# Altium project EDR Project.PrjPcb
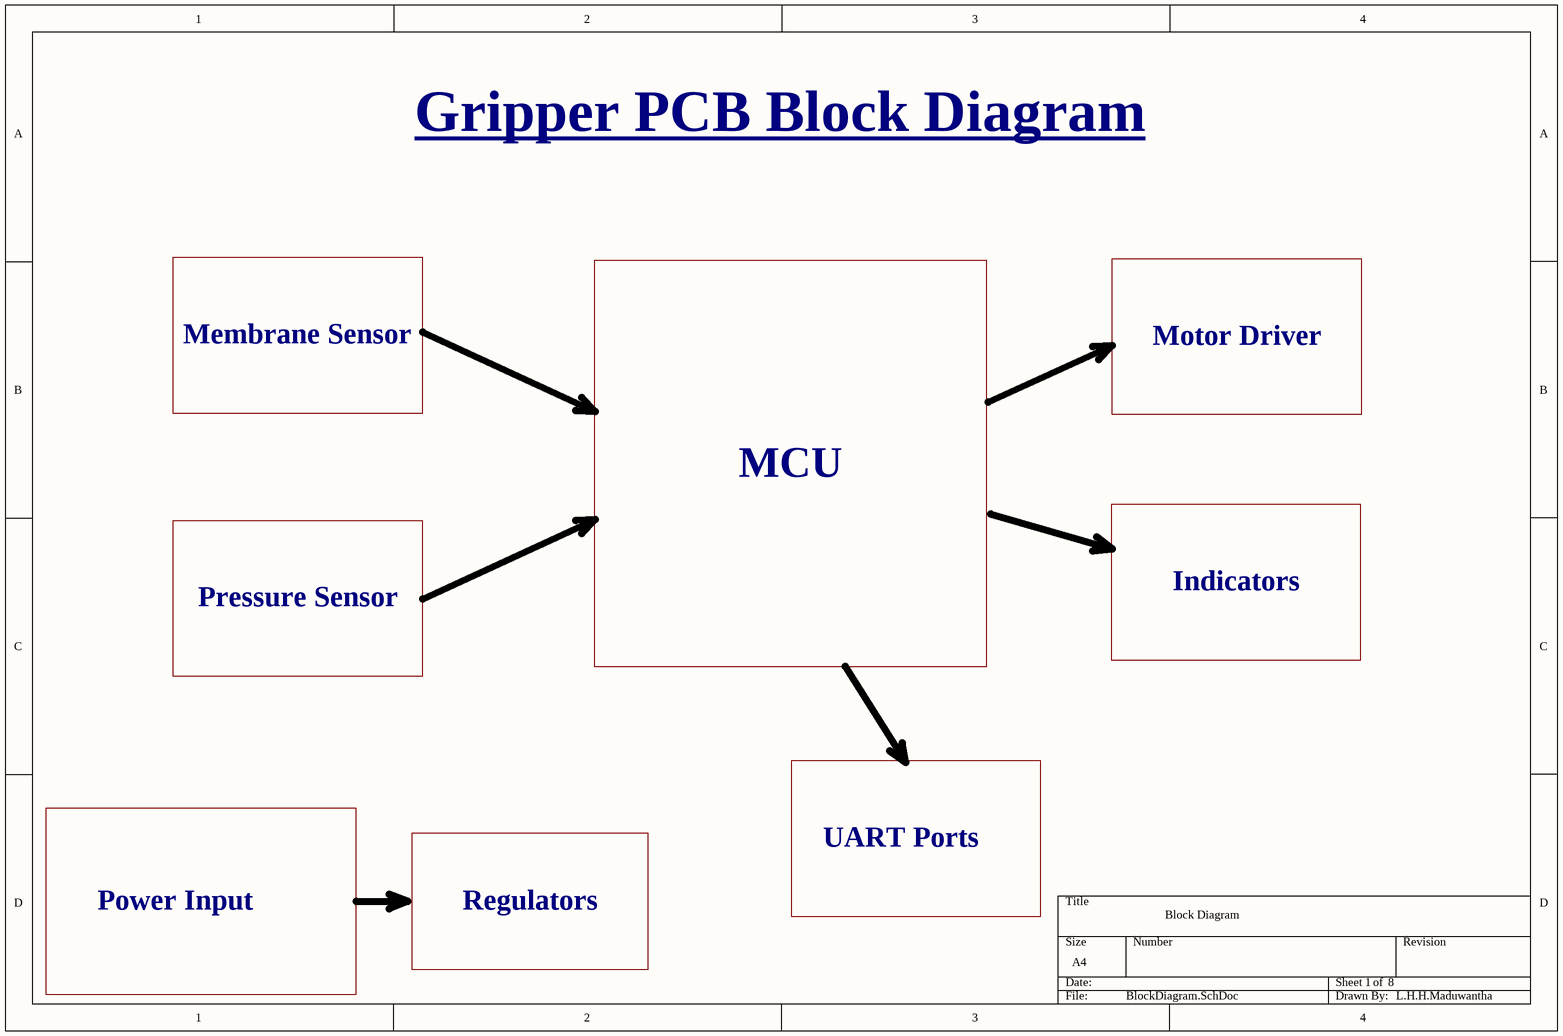
[diagram p0: BlockDiagram.SchDoc]
8 sheets, 58 parts. Net scope: hierarchical (ports join the sheet entries above them; power ports are global).
Board file: EDR Project pcb.PcbDoc
Sheets:
  BlockDiagram.SchDoc
  Main.SchDoc
    MCU = MCU.SchDoc
    POWER = Power.SchDoc
    MOTOR DRIVER = MotorDriver.SchDoc
    MEMBRANE SENSOR = MembraneSensor.SchDoc
    PRESSURE SENSOR = PressureSensor.SchDoc
    UART = UART_COM.SchDoc

## Sheet BlockDiagram.SchDoc
size A4; SheetNumber: 1; SheetTotal: 8

### Notes on the sheet
- Gripper PCB Block Diagram
- Membrane Sensor
- Motor Driver
- MCU
- Pressure Sensor
- Indicators
- UART Ports
- Power Input
- Regulators
- Block Diagram
- L.H.H.Maduwantha

## Sheet Main.SchDoc
size A4; SheetNumber: 2; SheetTotal: 8
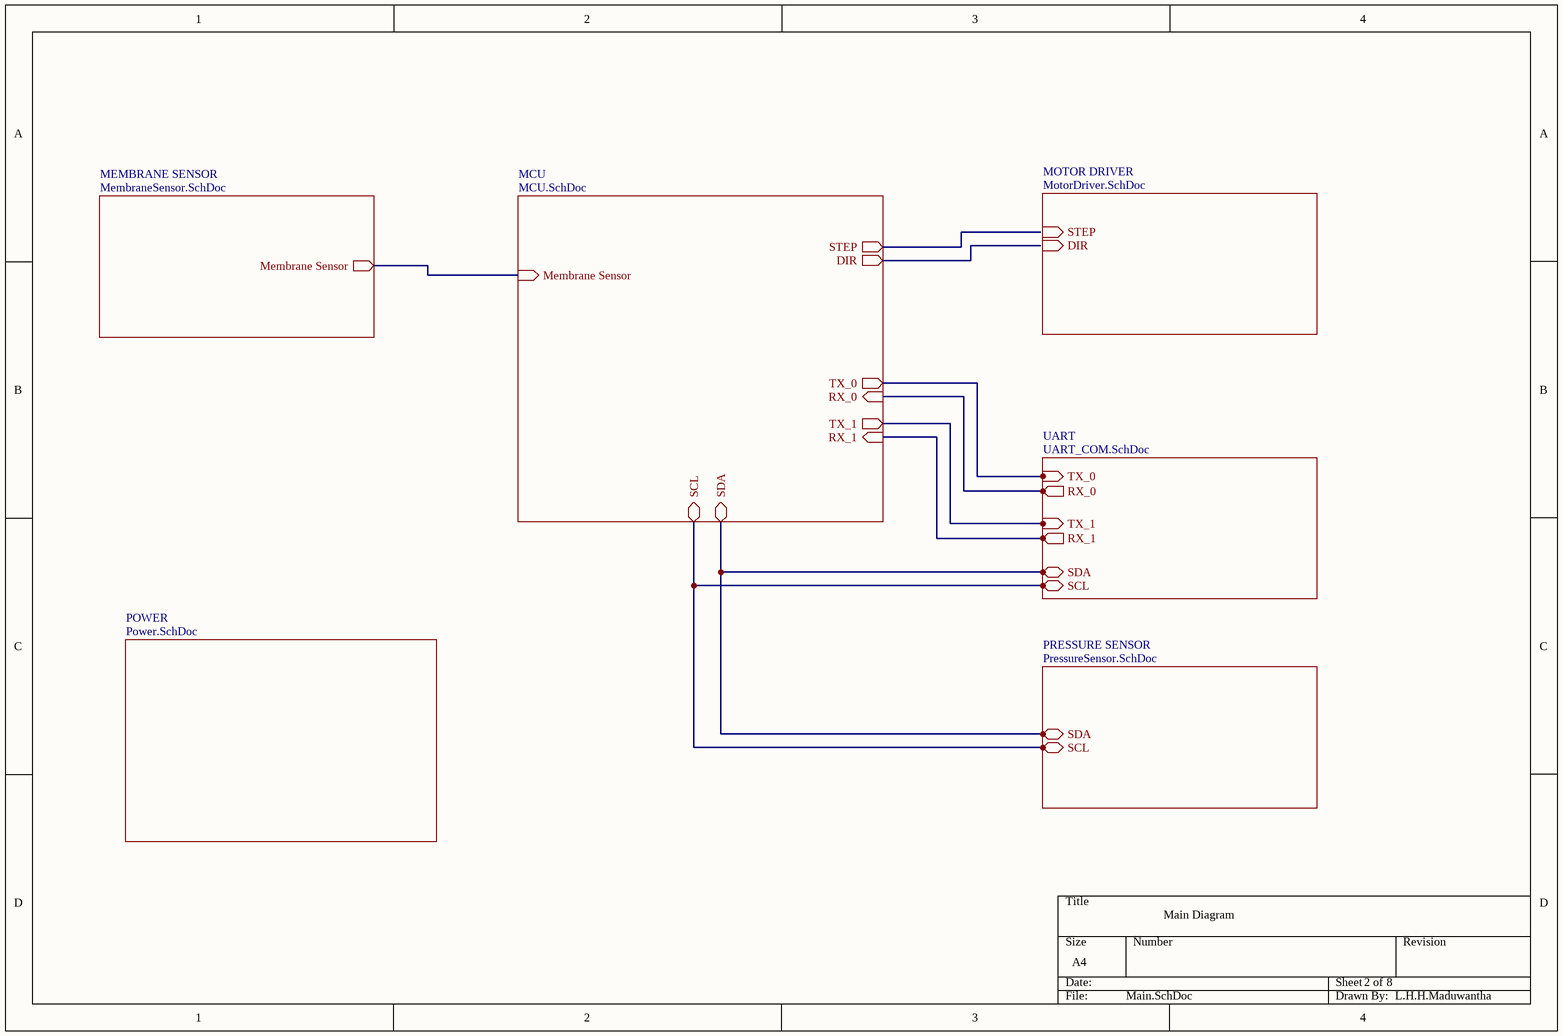
[diagram p1: Main.SchDoc]

### Sub-sheets
MCU = MCU.SchDoc: TX_1 (out), RX_1 (in), TX_0 (out), RX_0 (in), SCL (bidir), SDA (bidir), STEP (out), DIR (out), Membrane Sensor (in)
MEMBRANE SENSOR = MembraneSensor.SchDoc: Membrane Sensor (out)
MOTOR DRIVER = MotorDriver.SchDoc: STEP (in), DIR (in)
POWER = Power.SchDoc: no entries
PRESSURE SENSOR = PressureSensor.SchDoc: SDA (bidir), SCL (bidir)
UART = UART_COM.SchDoc: TX_0 (in), RX_0 (out), SDA (bidir), SCL (bidir), TX_1 (in), RX_1 (out)

### Nets
SCL: sheet MCU/SCL, sheet PRESSURE SENSOR/SCL, sheet UART/SCL
SDA: sheet MCU/SDA, sheet PRESSURE SENSOR/SDA, sheet UART/SDA
NetIC1_2: sheet MCU/RX_0, sheet UART/RX_0
NetIC1_3: sheet MCU/TX_0, sheet UART/TX_0
NetIC1_45: sheet MCU/RX_1, sheet UART/RX_1
NetIC1_46: sheet MCU/TX_1, sheet UART/TX_1
NetIC1_97: sheet MCU/Membrane Sensor, sheet MEMBRANE SENSOR/Membrane Sensor

### Notes on the sheet
- Main Diagram
- L.H.H.Maduwantha

## Sheet MCU.SchDoc
size A4; SheetNumber: 3; SheetTotal: 8
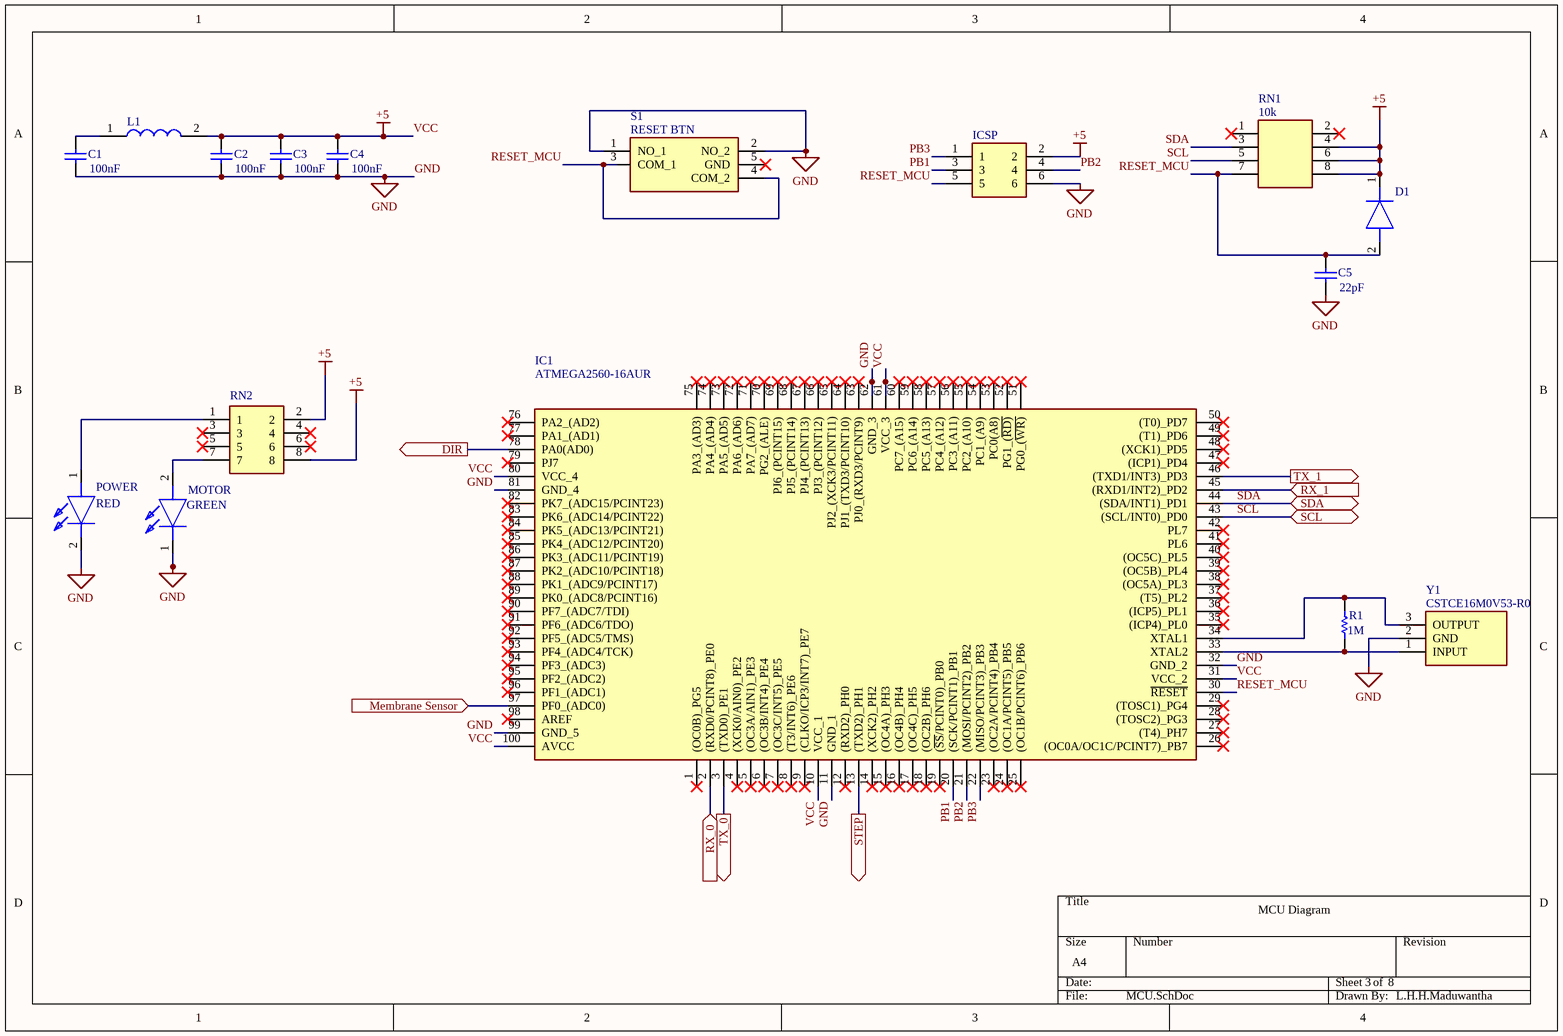
[diagram p2: MCU.SchDoc]

### Parts
C1  value 100nF  [CAPC1608X90X35LL15T15]  (hidden comment: 06035C104KAT4A)
C2  value 100nF  [CAPC1608X90X35LL15T15]  (hidden comment: 06035C104KAT4A)
C3  value 100nF  [CAPC1608X90X35LL15T15]  (hidden comment: 06035C104KAT4A)
C4  value 100nF  [CAPC1608X90X35LL15T15]  (hidden comment: 06035C104KAT4A)
C5  value 22pF  [CAPC1608X90X35NL15T15]  (hidden comment: 06035A220JAT4A)
D1  CD1206-S01575  [DIOC3215X95N]  (value not drawn)
IC1  ATMEGA2560-16AUR  [QFP50P1600X1600X120-100N]
ICSP  PH2-06-UA  [HDRV6W64P254_2X3_762X500X901P]  (value not drawn)
L1  CV201210-100K  [INDC2012X145N]  (value not drawn)
MOTOR  Color: GREEN  [LEDM2012X120N]  (hidden comment: KPT-2012SGC)
POWER  COLOR: RED  [APT2012SECKJ3PRV]  (hidden comment: APT2012SECK_J3-PRV)
R1  value 1M  [RESC1608X55X30NL15T15]  (hidden comment: ERJ-3GEYJ105V)
RN1  value 10k  [CAY16-J4]  (hidden comment: CAY16-103J4GLF)
RN2  CAY16-102J4LF  [CAY16-103J4LF]  (value not drawn)
S1  NAME: RESET BTN  [15716363]  (hidden comment: 1571636-3)
Y1  CSTCE16M0V53-R0  [CSTCE16M0V53R0]

### Ports
DIR (out, see Main[3A]), Membrane Sensor (in, see Main[2B], MembraneSensor[2B]), RX_0 (in, see Main[3B], UART_COM[2B]), RX_1 (in, see Main[3B], UART_COM[2B]), SCL (bidir, see Main[2C], PressureSensor[2C], UART_COM[2C]), SDA (bidir, see Main[2C], PressureSensor[2C], UART_COM[2C]), STEP (out, see Main[3A]), TX_0 (out, see Main[3B], UART_COM[2B]), TX_1 (out, see Main[3B], UART_COM[2B])

### Nets
GND: C1.1 C2.1 C3.1 C4.1 C5.1 IC1.11(GND_1) IC1.32(GND_2) IC1.62(GND_3) IC1.81(GND_4) IC1.99(GND_5) ICSP.6 MOTOR.1(K) POWER.2(K) S1.1(NO_1) S1.2(NO_2) Y1.2(GND)
VCC: C2.2 C3.2 C4.2 D1.1(K) IC1.10(VCC_1) IC1.31(VCC_2) IC1.61(VCC_3) IC1.80(VCC_4) IC1.100(AVCC) ICSP.2 L1.2 RN1.4 RN1.6 RN1.8 RN2.2 RN2.8  [also labelled +5]
PB1: IC1.20((SCK/PCINT1)_PB1) ICSP.3
PB2: IC1.21((MOSI/PCINT2)_PB2) ICSP.4
PB3: IC1.22((MISO/PCINT3)_PB3) ICSP.1
RESET_MCU: C5.2 D1.2(A) IC1.30(~{RESET}) ICSP.5 RN1.7 S1.3(COM_1) S1.4(COM_2)
SCL: IC1.43((SCL/INT0)_PD0) RN1.5 ; port SCL
SDA: IC1.44((SDA/INT1)_PD1) RN1.3 ; port SDA
NetC1_2: C1.2 L1.1
NetIC1_2: IC1.2((RXD0/PCINT8)_PE0) ; port RX_0
NetIC1_3: IC1.3((TXD0)_PE1) ; port TX_0
NetIC1_13: IC1.13((TXD2)_PH1) ; port STEP
NetIC1_33: IC1.33(XTAL2) R1.1 Y1.1(INPUT)
NetIC1_34: IC1.34(XTAL1) R1.2 Y1.3(OUTPUT)
NetIC1_45: IC1.45((RXD1/INT2)_PD2) ; port RX_1
NetIC1_46: IC1.46((TXD1/INT3)_PD3) ; port TX_1
NetIC1_78: IC1.78(PA0(AD0)) ; port DIR
NetIC1_97: IC1.97(PF0_(ADC0)) ; port Membrane Sensor
NetMOTOR_2: MOTOR.2(A) RN2.7
NetPOWER_1: POWER.1(A) RN2.1

Not connected (* = marked no-connect by the designer): IC1 1((OC0B)_PG5)* 4((XCK0/AIN0)_PE2)* 5((OC3A/AIN1)_PE3)* 6((OC3B/INT4)_PE4)* 7((OC3C/INT5)_PE5)* 8((T3/INT6)_PE6)* 9((CLKO/ICP3/INT7)_PE7)* 12((RXD2)_PH0)* 14((XCK2)_PH2)* 15((OC4A)_PH3)* 16((OC4B)_PH4)* 17((OC4C)_PH5)* 18((OC2B)_PH6)* 19((~{SS}/PCINT0)_PB0)* 23((OC2A/PCINT4)_PB4)* 24((OC1A/PCINT5)_PB5)* 25((OC1B/PCINT6)_PB6)* 26((OC0A/OC1C/PCINT7)_PB7)* 27((T4)_PH7)* 28((TOSC2)_PG3)* 29((TOSC1)_PG4)* 35((ICP4)_PL0)* 36((ICP5)_PL1)* 37((T5)_PL2)* 38((OC5A)_PL3)* 39((OC5B)_PL4)* 40((OC5C)_PL5)* 41(PL6)* 42(PL7)* 47((ICP1)_PD4)* 48((XCK1)_PD5)* 49((T1)_PD6)* 50((T0)_PD7)* 51(PG0_(~{WR)})* 52(PG1_(~{RD)})* 53(PC0(A8))* 54(PC1_(A9))* 55(PC2_(A10))* 56(PC3_(A11))* 57(PC4_(A12))* 58(PC5_(A13))* 59(PC6_(A14))* 60(PC7_(A15))* 63(PJ0_(RXD3/PCINT9))* 64(PJ1_(TXD3/PCINT10))* 65(PJ2_(XCK3/PCINT11))* 66(PJ3_(PCINT12))* 67(PJ4_(PCINT13))* 68(PJ5_(PCINT14))* 69(PJ6_(PCINT15))* 70(PG2_(ALE))* 71(PA7_(AD7))* 72(PA6_(AD6))* 73(PA5_(AD5))* 74(PA4_(AD4))* 75(PA3_(AD3))* 76(PA2_(AD2))* 77(PA1_(AD1))* 79(PJ7)* 82(PK7_(ADC15/PCINT23))* 83(PK6_(ADC14/PCINT22))* 84(PK5_(ADC13/PCINT21))* 85(PK4_(ADC12/PCINT20))* 86(PK3_(ADC11/PCINT19))* 87(PK2_(ADC10/PCINT18))* 88(PK1_(ADC9/PCINT17))* 89(PK0_(ADC8/PCINT16))* 90(PF7_(ADC7/TDI))* 91(PF6_(ADC6/TDO))* 92(PF5_(ADC5/TMS))* 93(PF4_(ADC4/TCK))* 94(PF3_(ADC3))* 95(PF2_(ADC2))* 96(PF1_(ADC1))* 98(AREF)*; RN1 1* 2*; RN2 3* 4* 5* 6*; S1 5(GND)*

### Notes on the sheet
- MCU Diagram
- L.H.H.Maduwantha

### Library data of the parts
C1-C4 = CMP-2006-04390-1: Manufacturer: AVX Interconnect / Elco; Part Number: 06035C104KAT4A
C5 = CMP-2006-04271-1: Manufacturer: AVX Interconnect / Elco; Part Number: 06035A220JAT4A
D1 = CD1206-S01575: Diode; Manufacturer_Name: Bourns; Datasheet Link: https://datasheet.datasheetarchive.com/originals/distributors/SFDatasheet-7/sf-000140098.pdf; Height: 0.95mm; Manufacturer_Part_Number: CD1206-S01575; Mouser Part Number: 652-CD1206-S01575; Mouser Price/Stock: https://www.mouser.co.uk/ProductDetail/Bourns/CD1206-S01575?qs=FITO%2F%2FQgYDlGQsqciGRLTg%3D%3D; Arrow Part Number: CD1206-S01575; Arrow Price/Stock: https://www.arrow.com/en/products/cd1206-s01575/bourns
IC1 = ATMEGA2560-16AUR: Integrated Circuit; Manufacturer_Name: Microchip; Datasheet Link: http://ww1.microchip.com/downloads/en/DeviceDoc/Atmel-2549-8-bit-AVR-Microcontroller-ATmega640-1280-1281-2560-2561_datasheet.pdf; Height: 1.2mm; Manufacturer_Part_Number: ATMEGA2560-16AUR; Mouser Part Number: 556-ATMEGA2560-16AUR; Mouser Price/Stock: https://www.mouser.co.uk/ProductDetail/Microchip-Technology/ATMEGA2560-16AUR?qs=6Dg1WZIWLC5tcX5fO8xzXQ%3D%3D; Arrow Part Number: ATMEGA2560-16AUR; Arrow Price/Stock: https://www.arrow.com/en/products/atmega2560-16aur/microchip-technology?region=nac
ICSP = PH2-06-UA: Connector; Manufacturer_Name: Adam Tech; Datasheet Link: https://datasheet.datasheetarchive.com/originals/distributors/Datasheets_SAMA/c63e3fe101e7b6e3957e7ad4a1a98367.pdf; Height: 9.008mm; Manufacturer_Part_Number: PH2-06-UA; Arrow Part Number: PH2-06-UA; Arrow Price/Stock: https://www.arrow.com/en/products/ph2-06-ua/adam-tech?region=nac
L1 = CV201210-100K: Inductor; Manufacturer_Name: Bourns; Datasheet Link: https://www.bourns.com/docs/Product-Datasheets/CV201210.pdf; Height: 1.45mm; Manufacturer_Part_Number: CV201210-100K; Mouser Part Number: 652-CV201210-100K; Mouser Price/Stock: https://www.mouser.co.uk/ProductDetail/Bourns/CV201210-100K?qs=k2%252BVLg4AuuRLt64STpwovw%3D%3D; Arrow Part Number: CV201210-100K; Arrow Price/Stock: https://www.arrow.com/en/products/cv201210-100k/bourns?region=nac
MOTOR = KPT-2012SGC: LED; Manufacturer_Name: Kingbright; Datasheet Link: https://componentsearchengine.com/Datasheets/2/KPT-2012SGC.pdf; Height: 1.2mm; Manufacturer_Part_Number: KPT-2012SGC; Mouser Part Number: N/A; Mouser Price/Stock: https://www.mouser.co.uk/ProductDetail/Kingbright/KPT-2012SGC?qs=2JU0tDl2GZ3Evsz5LVxRxw%3D%3D; Arrow Part Number: KPT-2012SGC; Arrow Price/Stock: https://www.arrow.com/en/products/kpt-2012sgc/kingbright?region=europe
POWER = APT2012SECK_J3-PRV: LED; Manufacturer_Name: Kingbright; Manufacturer_Part_Number: APT2012SECK/J3-PRV; Datasheet Link: https://www.mouser.de/datasheet/2/216/APT2012SECK-J3-PRV-1173389.pdf; Height: 0.85mm; Mouser Part Number: 604-APT2012SECKJ3PRV; Mouser Price/Stock: https://www.mouser.co.uk/ProductDetail/Kingbright/APT2012SECK-J3-PRV?qs=D2TOvUWgdJ6T9J6WfI%252BQOg%3D%3D; Arrow Part Number: APT2012SECK/J3-PRV; Arrow Price/Stock: https://www.arrow.com/en/products/apt2012seckj3-prv/kingbright?region=nac
R1 = CMP-2000-00706-1: Manufacturer: Panasonic; Part Number: ERJ-3GEYJ105V
RN1 = CAY16-103J4GLF: Resistor Network; Manufacturer_Name: Bourns; Datasheet Link: http://www.bourns.com/docs/Product-Datasheets/CATCAY.pdf; Manufacturer_Part_Number: CAY16-103J4GLF; Mouser Part Number: 652-CAY16-103J4GLF; Mouser Price/Stock: https://www.mouser.co.uk/ProductDetail/Bourns/CAY16-103J4GLF?qs=ehdiChDUEdVKSWacpiiZig%3D%3D; Arrow Part Number: CAY16-103J4GLF; Arrow Price/Stock: https://www.arrow.com/en/products/cay16-103j4glf/bourns
RN2 = CAY16-102J4LF: Resistor Network; Manufacturer_Name: Bourns; Datasheet Link: http://www.bourns.com/docs/Product-Datasheets/CATCAY.pdf; Manufacturer_Part_Number: CAY16-102J4LF; Mouser Part Number: 652-CAY16-102J4LF; Mouser Price/Stock: https://www.mouser.co.uk/ProductDetail/Bourns/CAY16-102J4LF?qs=LCMWAU1DZcxTp%252BoNHGBb3Q%3D%3D; Arrow Part Number: CAY16-102J4LF; Arrow Price/Stock: https://www.arrow.com/en/products/cay16-102j4lf/bourns?region=europe
S1 = 1571636-3: Switch; Manufacturer_Name: TE Connectivity; Datasheet Link: https://www.mouser.com/datasheet/2/418/NG_CD_1571636_C2-652439.pdf; Height: 2.5mm; Manufacturer_Part_Number: 1571636-3; Mouser Part Number: 506-1571636-3; Mouser Price/Stock: https://www.mouser.co.uk/ProductDetail/TE-Connectivity-Alcoswitch/1571636-3?qs=9qK3lZr%252Bi0Iiy0ZiPH8Cfg%3D%3D
Y1 = CSTCE16M0V53-R0: Crystal or Oscillator; Manufacturer_Name: Murata Electronics; Value: 16MHz; Datasheet Link: https://www.murata.com/en-sg/products/productdetail?partno=CSTCE16M0V53-R0; Height: 1mm; Manufacturer_Part_Number: CSTCE16M0V53-R0; Mouser Part Number: 81-CSTCE16M0V53-R0; Mouser Price/Stock: https://www.mouser.co.uk/ProductDetail/Murata-Electronics/CSTCE16M0V53-R0?qs=HPA2Xx%252BU0WhPWbRcNuzhZw%3D%3D

## Sheet Power.SchDoc
size A4; SheetNumber: 5; SheetTotal: 8
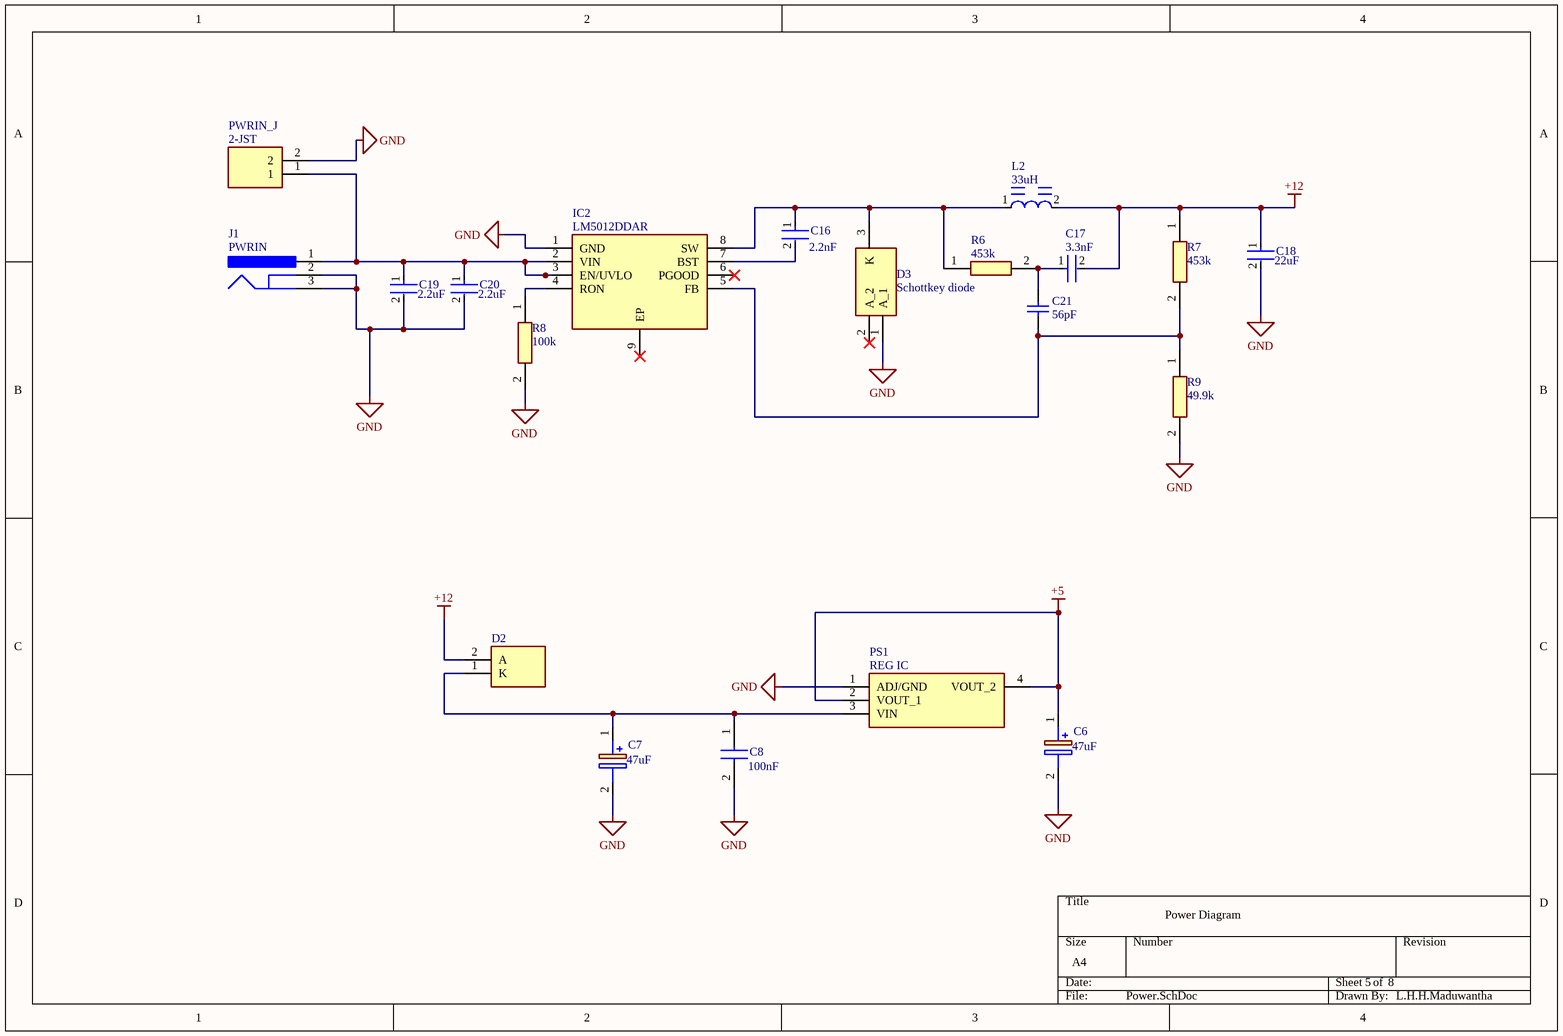
[diagram p3: Power.SchDoc]

### Parts
C6  value 47uF  [EEE1AA101SP]  (hidden comment: EEE-1EA470WP)
C7  value 47uF  [EEE1AA101SP]  (hidden comment: EEE-1EA470WP)
C8  Capacitance: 100nF  [C0603]  (hidden comment: C0603C104K5RAC3190)
C16  Capacitance: 2.2nF  [FP-GRM155-0_05-IPC_C]  (hidden comment: GRM155R71H222JA01D)
C17  Capacitance: 3.3nF  [FP-1206-L_3_2_0_2-W_1_6_0-IPC_C]  (hidden comment: 12065C332KAT2A)
C18  Capacitance: 22uF  [FP-GRM21B-0_15-MFG]  (hidden comment: GRM21BR60J226ME39L)
C19  Capacitance: 2.2uF  [FP-GCM31C-0_2-e0_3_0_8-MFG]  (hidden comment: GCM31CR71H225KA55K)
C20  Capacitance: 2.2uF  [FP-GCM31C-0_2-e0_3_0_8-MFG]  (hidden comment: GCM31CR71H225KA55K)
C21  Capacitance: 56pF  [CAPC0603X33X15ML03T05]  (hidden comment: 02015C560KAT2A)
D2  CGRA4007-G  [DIOM5127X229N]  (value not drawn)
D3  Name: Schottkey diode  [V8P12M386A]  (hidden comment: V8P12-M3_86A)
IC2  LM5012DDAR  [SOIC127P600X170-9N]
J1  NAME: PWRIN  [CUI-PJ-102BH_V]  (hidden comment: PJ-102BH)
L2  Inductance: 33uH  [FP-SRR1280-MFG]  (hidden comment: SRR1280-330M)
PS1  NAME: REG IC  [SOT230P700X170-4N]  (hidden comment: SPX1117M3-L-5-0_TR)
PWRIN_J  Name: 2-JST  [B2BXHAMLFSN]  (hidden comment: B2B-XH-AM_LF__SN_)
R6  Resistance: 453k  [ERJS1T_U1T_(2512)]  (hidden comment: ERJ-S1TD4533U)
R7  Resistance: 453k  [ERJS1T_U1T_(2512)]  (hidden comment: ERJ-S1TD4533U)
R8  Resistance: 100k  [RESC7142X120N]  (hidden comment: 3540100KJT)
R9  Resistor: 49.9k  [RESC6332X70N]  (hidden comment: CRCW251249K9FKEG)

### Nets
+5: C6.1(+) PS1.2(VOUT_1) PS1.4(VOUT_2)  [project net VCC]
+12: C17.2 C18.1 D2.2(A) L2.2 R7.1
GND: C6.2(-) C7.2(-) C8.2 C18.2 C19.2 C20.2 D3.1(A_1) IC2.1(GND) J1.2 J1.3 PS1.1(ADJ/GND) PWRIN_J.2 R8.2 R9.2
NetC7_1: C7.1(+) C8.1 D2.1(K) PS1.3(VIN)
NetC16_1: C16.1 D3.3(K) IC2.8(SW) L2.1 R6.1
NetC16_2: C16.2 IC2.7(BST)
NetC17_1: C17.1 C21.2 R6.2
NetC19_1: C19.1 C20.1 IC2.2(VIN) IC2.3(EN/UVLO) J1.1 PWRIN_J.1
NetC21_1: C21.1 IC2.5(FB) R7.2 R9.1
NetIC2_4: IC2.4(RON) R8.1

Not connected (* = marked no-connect by the designer): D3 2(A_2)*; IC2 6(PGOOD)* 9(EP)*

### Notes on the sheet
- Power Diagram
- L.H.H.Maduwantha

### Library data of the parts
C6 C7 = EEE-1EA470WP: Capacitor Polarised; Manufacturer_Name: Panasonic; Voltage: 25V; Datasheet Link: http://industrial.panasonic.com/cdbs/www-data/pdf/RDE0000/ABA0000C1145.pdf; Height: 7.8mm; Manufacturer_Part_Number: EEE-1EA470WP; Mouser Part Number: 667-EEE-1EA470WP; Mouser Price/Stock: https://www.mouser.co.uk/ProductDetail/Panasonic/EEE-1EA470WP?qs=ANJC8C65Mw4aAM55A7BE%2Fw%3D%3D; Arrow Part Number: EEE-1EA470WP; Arrow Price/Stock: https://www.arrow.com/en/products/eee-1ea470wp/panasonic?region=nac
C8 = C0603C104K5RAC3190: Capacitor; Manufacturer_Name: KEMET; Datasheet Link: https://content.kemet.com/datasheets/KEM_C1023_X7R_AUTO_SMD.pdf; Height: 0.87mm; Manufacturer_Part_Number: C0603C104K5RAC3190; Mouser Part Number: 80-C0603C104K5R3190; Mouser Price/Stock: https://www.mouser.co.uk/ProductDetail/KEMET/C0603C104K5RAC3190?qs=OycAS1CGnljhMsmpVYrMLA%3D%3D; Arrow Part Number: C0603C104K5RAC3190; Arrow Price/Stock: https://www.arrow.com/en/products/c0603c104k5rac3190/kemet-corporation?region=nac
C16 = CMP-2008-04651-2: Chip Multilayer Ceramic Capacitors for General Purpose, 0402, 2200pF, X7R, 15%, 5%, 50V; Max Operating Temperature: 125°C; Tolerance: 5%; Voltage: 50V; Height: 0.5mm; Min Operating Temperature: -55°C; Lead Free: Lead Free; Voltage Rating (DC): 50V; Package Quantity: 10000; Voltage Rating: 50V; Depth: 0.5mm; Mount: Surface Mount; Termination: SMD/SMT; Radiation Hardening: No; Case Code (Imperial): 0402; Case/Package: 0402; Case Code (Metric): 1005; Thickness: 0.022inch; Dielectric: X7R; Width: 0.02inch; Packaging: Tape and Reel; Length: 1mm
C17 = CMP-04427-015080-1: General Purpose Ceramic Capacitor, 1206, 3.3nF, 10%, X7R, 15%, 50V; Dissipation Factor: 2.5%; Package Quantity: 1; Voltage Rating (DC): 50V; REACH SVHC: No SVHC; Lead Free: Lead Free; Min Operating Temperature: -55°C; Voltage Rating: 50V; Max Operating Temperature: 125°C; Thickness: 0.037inch; Case/Package: 1206; Height: 0.94mm; Mount: Surface Mount; Contact Plating: Tin; Voltage: 50V; Construction: Flat; Length: 3.2mm; Case Code (Imperial): 1206; Dielectric Material: Ceramic; Dielectric: X7R; Tolerance: 10%; Case Code (Metric): 3216; Number of Pins: 2; Depth: 1.6mm; Series: -; Width: 1.6mm; Packaging: Tape and Reel; RoHS Compliant: Yes; Termination: SMD/SMT
C18 = CMP-2007-03385-2: Chip Multilayer Ceramic Capacitors for General Purpose, 0805, 22uF, X5R, 15%, 20%, 6.3V; Material: Ceramic; Max Operating Temperature: 85°C; Voltage: 6.3V; Min Operating Temperature: -55°C; Case/Package: 0805; Thickness: 0.053inch; Dielectric: X5R; Packaging: Tape and Reel; Depth: 1.25mm; Termination: SMD/SMT; Voltage Rating (DC): 6.3V; Radiation Hardening: No; Tolerance: 20%; Mount: Surface Mount; Lead Free: Lead Free; Package Quantity: 1; REACH SVHC: No SVHC; Voltage Rating: 6.3V; Length: 2mm; Case Code (Imperial): 0805; Case Code (Metric): 2012; Width: 0.049inch; Height: 1.25mm
C19 C20 = CMP-06035-059276-1: Ceramic Capacitor for Automotive 2.2uF ±10% 50VDC X7R 1206 Embossed T/R; Voltage Rating (DC): 50V; Thickness: 0.071inch; Width: 0.063inch; Length: 3.2mm; Min Operating Temperature: -55°C; Case Code (Metric): 3216; Height: 1.6mm; Voltage Rating: 50V; Packaging: Tape and Reel; Max Operating Temperature: 125°C; Dielectric: X7R; Depth: 1.6mm; Tolerance: 10%; Case Code (Imperial): 1206; Case/Package: 1206; Lead Free: Lead Free; Package Quantity: 6000; Termination: SMD/SMT; Ratings: AEC-Q200; Mount: Surface Mount; Radiation Hardening: No
C21 = CMP-2010-00470-1: Manufacturer: AVX Interconnect / Elco; Part Number: 02015C560KAT2A
D2 = CGRA4007-G: Integrated Circuit; Manufacturer_Name: Comchip Technology; Datasheet Link: http://www.mouser.com/datasheet/2/80/CGRA4001-G_Thru647977._CGRA4007-G_RevE-1481051.pdf; Height: 2.29mm; Manufacturer_Part_Number: CGRA4007-G; Mouser Part Number: 750-CGRA4007-G; Mouser Price/Stock: https://www.mouser.co.uk/ProductDetail/Comchip-Technology/CGRA4007-G?qs=tw%252BuQ%2FB6PO1Jgp22ji8v0g%3D%3D; Arrow Part Number: CGRA4007-G; Arrow Price/Stock: https://www.arrow.com/en/products/cgra4007-g/comchip-technology
D3 = V8P12-M3_86A: Diode; Manufacturer_Name: Vishay; Manufacturer_Part_Number: V8P12-M3/86A; Datasheet Link: https://www.vishay.com/docs/89170/v8p12.pdf; Height: 1.2mm; Mouser Part Number: 78-V8P12-M3/86A; Mouser Price/Stock: https://www.mouser.co.uk/ProductDetail/Vishay-General-Semiconductor/V8P12-M3-86A?qs=HSPD0Bff7iYR%2FGS73JOLOg%3D%3D; Arrow Part Number: V8P12-M3/86A; Arrow Price/Stock: https://www.arrow.com/en/products/v8p12-m386a/vishay?region=nac
IC2 = LM5012DDAR: Integrated Circuit; Manufacturer_Name: Texas Instruments; Datasheet Link: https://www.ti.com/lit/ds/symlink/lm5012.pdf?ts=1682242115443&ref_url=https%253A%252F%252Fwww.ti.com%252Fproduct%252FLM5012; Height: 1.7mm; Manufacturer_Part_Number: LM5012DDAR; Mouser Part Number: 595-LM5012DDAR; Mouser Price/Stock: https://www.mouser.co.uk/ProductDetail/Texas-Instruments/LM5012DDAR?qs=T%252BzbugeAwjjzO1eNFM2OsQ%3D%3D; Arrow Part Number: LM5012DDAR; Arrow Price/Stock: https://www.arrow.com/en/products/lm5012ddar/texas-instruments?region=nac
J1 = CMP-2000-06901-1: Through Hole Right Angle DC Power Jack, 5 A, 2.5 mm Center Pin, 3 Position, -25 to 85 degC, RoHS, Bulk; Manufacturer: CUIInc.; Outside Contact Diameter: 6.5mm; Current Rating: 5A; Brand: CUI; Insulation Resistance: 100MOhms; Inside Contact Diameter: 2.5mm; Voltage Rating: 24V; Operating Temperature Range: -25Cto+85C; Mounting Angle: Right; Mounting Technology: ThroughHole; Product Category: DCPowerConnectors; Datasheet Version: Rev. 1.02, 05/2016; Connector Type: DCPowerJack; Contact Material: Copper; Housing Material: PolybutyleneTerephthalate(PBT); Mounting Style: ThroughHole; Product: Jacks; Package Reference: PJ-102BH; Manufacturer URL: http://www.cui.com/; RoHS: True; Contact Gender: Male; Contact Plating: Nickel; Flammability Rating: UL94V-0; Factory Pack Quantity: 280; Datasheet URL: http://www.cui.com/product/resource/pj-102bh.pdf; Package Description: 3-Pin Through Hole Device, Body 14.4 x 9 mm, Height 11 mm; Termination Style: ThroughHole
L2 = CMP-2000-07148-2: FIXED IND 33UH 3.5A 57 MOHM SMD; Self Resonant Frequency: 9.5MHz; Saturation Current: 3.3A; Shielding: Shielded; Test Frequency: 100kHz; Core Material: Ferrite; Tolerance: 20%; Q Factor: 28; Resistance: 57MR; Material: Steel; RMS Current (Irms): 3.5A; Max DC Current: 3.5A; Height: 7.5mm; Frequency: 9.5MHz; Series: SRR1280; Length: 12.5mm; Military Standard: Not; Height - Seated (Max): 0.315inch; REACH SVHC: No SVHC; DC Current: 3.5A; Current Rating: 3.5A; Sample Rate (Hz): 100kHz; Min Operating Temperature: -40°C; RoHS Compliant: Yes; Width: 12.5mm; Packaging: Tape and Reel; Inductance Tolerance: 20%; Case/Package: Nonstandard; Radiation Hardening: No; Max Operating Temperature: 125°C; Number of Pins: 2; Depth: 12.8mm; Mount: Surface Mount; Termination: SMD/SMT; Package Quantity: 400; DC Resistance (DCR): 57mR; Resistor Type: Wirewound
PS1 = SPX1117M3-L-5-0_TR: Power Supply; Manufacturer_Name: EXAR; Manufacturer_Part_Number: SPX1117M3-L-5-0/TR; Datasheet Link: https://datasheet.datasheetarchive.com/originals/distributors/Datasheets-DGA25/1769206.pdf; Height: 1.7mm; Mouser Part Number: 701-SPX1117M3-L-50TR; Mouser Price/Stock: https://www.mouser.com/Search/Refine.aspx?Keyword=701-SPX1117M3-L-50TR; Arrow Part Number: SPX1117M3-L-5-0/TR; Arrow Price/Stock: https://www.arrow.com/en/products/spx1117m3-l-5-0tr/exar
PWRIN_J = B2B-XH-AM_LF__SN_: Connector; Manufacturer_Name: JST (JAPAN SOLDERLESS TERMINALS); Manufacturer_Part_Number: B2B-XH-AM(LF)(SN); Datasheet Link: https://www.jst-mfg.com/product/pdf/eng/eXH.pdf; Height: 7mm; Arrow Part Number: B2B-XH-AM(LF)(SN); Arrow Price/Stock: https://www.arrow.com/en/products/b2b-xh-am-lf-sn/jst-manufacturing?region=europe
R6 R7 = ERJ-S1TD4533U: Resistor; Manufacturer_Name: Panasonic; Datasheet Link: https://industrial.panasonic.com/cdbs/www-data/pdf/RDP0000/AOA0000C334.pdf; Height: 0.7mm; Manufacturer_Part_Number: ERJ-S1TD4533U
R8 = 3540100KJT: Resistor; Manufacturer_Name: TE Connectivity; Datasheet Link: https://www.te.com/commerce/DocumentDelivery/DDEController?Action=srchrtrv&DocNm=1773204-5&DocType=Data%20Sheet&DocLang=English&PartCntxt=3-2176402-2&DocFormat=pdf; Height: 1.2mm; Manufacturer_Part_Number: 3540100KJT
R9 = CRCW251249K9FKEG: Resistor; Manufacturer_Name: Vishay; Datasheet Link: http://www.vishay.com/docs/20035/dcrcwe3.pdf; Height: 0.7mm; Manufacturer_Part_Number: CRCW251249K9FKEG; Mouser Part Number: 71-CRCW2512-49.9K-E3; Mouser Price/Stock: https://www.mouser.com/Search/Refine.aspx?Keyword=71-CRCW2512-49.9K-E3

## Sheet MotorDriver.SchDoc
size A4; SheetNumber: 4; SheetTotal: 8
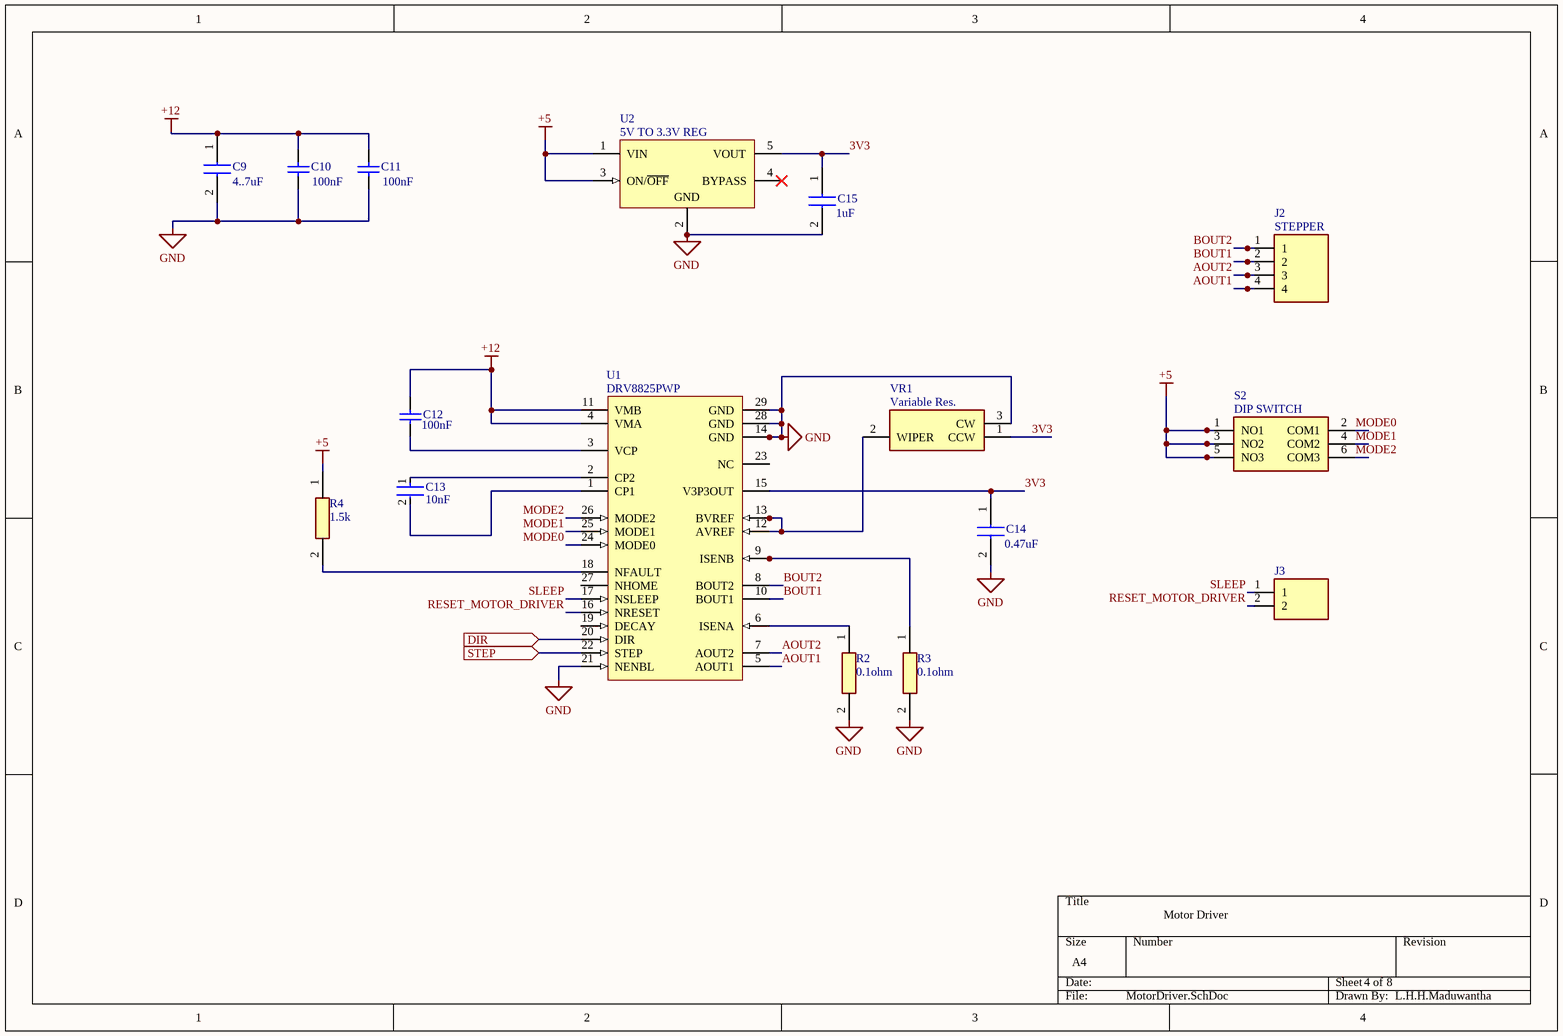
[diagram p4: MotorDriver.SchDoc]

### Parts
C9  Capacitance: 4..7uF  [C1210]  (hidden comment: C1210C475J5RACAUTO)
C10  value 100nF  [CAPC1608X90X35LL15T15]  (hidden comment: 06035C104KAT4A)
C11  value 100nF  [CAPC1608X90X35LL15T15]  (hidden comment: 06035C104KAT4A)
C12  value 100nF  [CAPC1608X90X35LL15T15]  (hidden comment: 06035C104KAT4A)
C13  Capacitance: 10nF  [FP-GRM155-0_05-IPC_A]  (hidden comment: GRM155R71H103JA88D)
C14  Capacitance: 0.47uF  [CAPC2012X110N]  (hidden comment: C0805C474J5REC7800)
C15  CAPACITANCE: 1uF  [CAPC1608X95N]  (hidden comment: C0603C105K3PACTU.)
J2  NAME: STEPPER  [B4BXHALFSN]  (hidden comment: B4B-XH-A_LF__SN_)
J3  61300211121  [HDRV2W110P0X254_1X2_508X254X854P]  (value not drawn)
R2  Resistance: 0.1ohm  [ERJ3_B_BQ_BW_LW_(0603)]  (hidden comment: ERJ-3RSFR10V)
R3  Resistance: 0.1ohm  [ERJ3_B_BQ_BW_LW_(0603)]  (hidden comment: ERJ-3RSFR10V)
R4  RESISTANCE: 1.5k  [ERA2AED122X]  (hidden comment: ERA-2AEB152X)
S2  NAME: DIP SWITCH  [BD03]  (hidden comment: BD03)
U1  DRV8825PWP  [PWP0028C_L]
U2  NAME: 5V TO 3.3V REG  [DBV0005A_M]  (hidden comment: LP2985-33DBVR)
VR1  NAME: Variable Res.  [TC33X2503E]  (hidden comment: TC33X-2-103E)

### Ports
DIR (in, see Main[3A]), STEP (in, see Main[3A])

### Nets
+5: R4.1 S2.1(NO1) S2.3(NO2) S2.5(NO3) U2.1(VIN) U2.3(ON/~{OFF})  [project net VCC]
+12: C9.1 C10.2 C11.2 C12.2 U1.4(VMA) U1.11(VMB)
GND: C9.2 C10.1 C11.1 C14.2 C15.2 R2.2 R3.2 U1.14(GND) U1.21(NENBL) U1.28(GND) U1.29(GND) U2.2(GND) VR1.3(CW)
3V3: C14.1 C15.1 U1.15(V3P3OUT) U2.5(VOUT) VR1.1(CCW)
AOUT1: J2.4 U1.5(AOUT1)
AOUT2: J2.3 U1.7(AOUT2)
BOUT1: J2.2 U1.10(BOUT1)
BOUT2: J2.1 U1.8(BOUT2)
MODE0: S2.2(COM1) U1.24(MODE0)
MODE1: S2.4(COM2) U1.25(MODE1)
MODE2: S2.6(COM3) U1.26(MODE2)
RESET_MOTOR_DRIVER: J3.2 U1.16(NRESET)
SLEEP: J3.1 U1.17(NSLEEP)
NetC12_1: C12.1 U1.3(VCP)
NetC13_1: C13.1 U1.2(CP2)
NetC13_2: C13.2 U1.1(CP1)
NetR2_1: R2.1 U1.6(ISENA)
NetR3_1: R3.1 U1.9(ISENB)
NetR4_2: R4.2 U1.18(NFAULT)
NetU1_12: U1.12(AVREF) U1.13(BVREF) VR1.2(WIPER)
NetU1_20: U1.20(DIR) ; port DIR
NetU1_22: U1.22(STEP) ; port STEP

Not connected (* = marked no-connect by the designer): U1 19(DECAY) 23(NC) 27(NHOME); U2 4(BYPASS)*

### Notes on the sheet
- Motor Driver
- L.H.H.Maduwantha

### Library data of the parts
C9 = C1210C475J5RACAUTO: Capacitor; Manufacturer_Name: KEMET; Datasheet Link: https://content.kemet.com/datasheets/KEM_C1023_X7R_AUTO_SMD.pdf; Manufacturer_Part_Number: C1210C475J5RACAUTO; Mouser Part Number: 80-C1210C475J5RAUTO; Mouser Price/Stock: https://www.mouser.co.uk/ProductDetail/KEMET/C1210C475J5RACAUTO?qs=sSYV1F9c5cHOvq7Y3pUhfA%3D%3D
C10-C12 = CMP-2006-04390-1: Manufacturer: AVX Interconnect / Elco; Part Number: 06035C104KAT4A
C13 = CMP-2008-04636-2: Chip Multilayer Ceramic Capacitors for General Purpose, 0402, 10000pF, X7R, 15%, 5%, 50V; Depth: 0.5mm; Case Code (Imperial): 0402; Dielectric: X7R; Voltage: 50V; Min Operating Temperature: -55°C; Packaging: Tape and Reel; Tolerance: 5%; Case Code (Metric): 1005; Package Quantity: 10000; Lead Free: Lead Free; Length: 1mm; Voltage Rating (DC): 50V; Termination: SMD/SMT; Width: 0.5mm; Height: 0.5mm; Voltage Rating: 50V; Case/Package: 0402; Max Operating Temperature: 125°C; Thickness: 0.022inch; Mount: Surface Mount; Material: Ceramic
C14 = C0805C474J5REC7800: Capacitor; Manufacturer_Name: KEMET; Datasheet Link: https://api.kemet.com/component-edge/download/datasheet/C0805C474J5REC7800.pdf; Height: 1.1mm; Manufacturer_Part_Number: C0805C474J5REC7800; Mouser Part Number: N/A; Mouser Price/Stock: https://www.mouser.co.uk/ProductDetail/KEMET/C0805C474J5REC7800?qs=xZ%2FP%252Ba9zWqYCFwa%2FovZJlA%3D%3D
C15 = C0603C105K3PACTU.: Capacitor; Manufacturer_Name: KEMET; Datasheet Link: https://www.kemet.com/specsheet/C0603C105K3PACTU; Height: 0.95mm; Manufacturer_Part_Number: C0603C105K3PACTU.; Mouser Part Number: N/A; Mouser Price/Stock: https://www.mouser.com/Search/Refine.aspx?Keyword=N%2FA
J2 = B4B-XH-A_LF__SN_: Connector; Manufacturer_Name: JST (JAPAN SOLDERLESS TERMINALS); Manufacturer_Part_Number: B4B-XH-A(LF)(SN); Datasheet Link: https://datasheet.lcsc.com/szlcsc/JST-Sales-America-B4B-XH-A-LF-SN_C144395.pdf; Height: 7mm; Arrow Part Number: B4B-XH-A(LF)(SN); Arrow Price/Stock: https://www.arrow.com/en/products/b4b-xh-a-lf-sn/jst-manufacturing?region=europe
J3 = 61300211121: Connector; Manufacturer_Name: Wurth Elektronik; Datasheet Link: https://componentsearchengine.com/Datasheets/2/61300211121.pdf; Height: 8.54mm; Manufacturer_Part_Number: 61300211121; Mouser Part Number: 710-61300211121; Mouser Price/Stock: https://www.mouser.co.uk/ProductDetail/Wurth-Elektronik/61300211121?qs=t4813l51qx%252B1A5GYDQxPlw%3D%3D
R2 R3 = ERJ-3RSFR10V: Resistor; Manufacturer_Name: Panasonic; Datasheet Link: http://industrial.panasonic.com/cdbs/www-data/pdf/RDN0000/AOA0000C313.pdf; Manufacturer_Part_Number: ERJ-3RSFR10V; Mouser Part Number: 667-ERJ-3RSFR10V; Mouser Price/Stock: https://www.mouser.co.uk/ProductDetail/Panasonic/ERJ-3RSFR10V?qs=aGgfWYEhH7mX3YEBaR1Eig%3D%3D; Arrow Part Number: ERJ-3RSFR10V; Arrow Price/Stock: https://www.arrow.com/en/products/erj-3rsfr10v/panasonic?region=nac
R4 = ERA-2AEB152X: Resistor; Manufacturer_Name: Panasonic; Datasheet Link: http://industrial.panasonic.com/cdbs/www-data/pdf/RDM0000/AOA0000C307.pdf; Height: 0.4mm; Manufacturer_Part_Number: ERA-2AEB152X; Mouser Part Number: 667-ERA-2AEB152X; Mouser Price/Stock: https://www.mouser.co.uk/ProductDetail/Panasonic/ERA-2AEB152X?qs=YFwoyZoVY0iUWeAxCO29sQ%3D%3D; Arrow Part Number: ERA-2AEB152X; Arrow Price/Stock: https://www.arrow.com/en/products/era-2aeb152x/panasonic?region=nac
S2 = BD03: Switch; Manufacturer_Name: C & K COMPONENTS; Datasheet Link: https://www.ckswitches.com/media/1331/bd.pdf; Manufacturer_Part_Number: BD03; Mouser Part Number: 611-BD03; Mouser Price/Stock: https://www.mouser.co.uk/ProductDetail/CK/BD03?qs=mh%2FGhdZp9qUYvDBbhZvRdQ%3D%3D; Arrow Part Number: BD03; Arrow Price/Stock: https://www.arrow.com/en/products/bd03/ck?region=nac
U1 = CMP-1685-00019-1: Stepper Motor Controller IC, 8.2 to 45 V, -40 to 85 degC, 28-Pin HTSSOP (PWP), Green (RoHS & no Sb/Br), Tube; Voltage Rating: 100 V; Tolerance: 20%; Capacitance: 47 uF; Case\Package: Radial; ComponentLink2URL: http://www.ti.com/general/docs/lit/getliterature.tsp?genericPartNumber=DRV8825&fileType=pdf; Voltage Rating (DC): 100 V; Lead Pitch: 3.5 mm; Diameter: 8 mm; DatasheetVersion: SLVSA73F, 07/2014; ComponentLink2Description: Datasheet; Package Quantity: 200; PackageDescription: 28-Pin Small Outline Package Integrated Circuit, Body 9.7 x 4.4 mm, Pitch 0.65 mm; Packaging: Bulk; Pins: 2; Min Operating Temperature: -40 degC; Width: 8 mm; ComponentLink1Description: Manufacturer URL; Length: 11.5 mm; Max Operating Temperature: 85 degC; Height: 11.5 mm; REACH SVHC: No SVHC; Mount: Through Hole; PackageReference: PWP0028C; RoHSCompliant: true; Radiation Hardening: No; ComponentLink1URL: http://www.ti.com/
U2 = CMP-0758-00080-2: Single Output Low Noise LDO, 150 mA, Fixed 3.3 V Output, 1.5% Tolerance, 2.2 to 16 V Input, Low IQ, 5-Pin SOT-23 (DBV), -40 to 125 degC, Green (RoHS & no Sb/Br), Tape and Reel; Manufacturer: Texas Instruments; Vdo (Typ) (mV): 280; Accuracy (%): 1.5; Output Options: Fixed Output; Fixed Output Options (V): 3.3; Iout (Max) (A): 0.15; Iq (Typ) (mA): 0.85; ComponentLink3Description: Package Specification; Packing: Tape and Reel; ComponentLink3URL: http://www.ti.com/litv/pdf/mpds018j; Vin (V): 2.2 to 16; Mounting Technology: Surface Mount; ComponentLink1URL: http://www.ti.com/; PartNumber: LP2985-33DBVR; PackageReference: DBV0005A; ComponentLink2URL: http://www.ti.com/lit/ds/symlink/lp2985-50.pdf; RoHS: TRUE; ComponentLink2Description: Datasheet; PackageVersion: 4073253-4/L; Operating Temperature Range (degC): -40 to 125; DatasheetVersion: SLVS522N; ComponentLink1Description: Manufacturer URL; PackageDescription: 5-Pin Plastic Small Outline, Body 2.9 x 1.6 mm, Pitch 0.95 mm
VR1 = TC33X-2-103E: Variable Resistor; Manufacturer_Name: Bourns; Datasheet Link: https://www.bourns.com/pdfs/TC33.pdf; Height: 1.2mm; Manufacturer_Part_Number: TC33X-2-103E; Mouser Part Number: 652-TC33X-2-103E; Mouser Price/Stock: https://www.mouser.co.uk/ProductDetail/Bourns/TC33X-2-103E?qs=fmZCN1JtwVHu68GrI%2FXOWQ%3D%3D; Arrow Part Number: TC33X-2-103E; Arrow Price/Stock: https://www.arrow.com/en/products/tc33x-2-103e/bourns?region=nac

## Sheet MembraneSensor.SchDoc
size A4; SheetNumber: 6; SheetTotal: 8
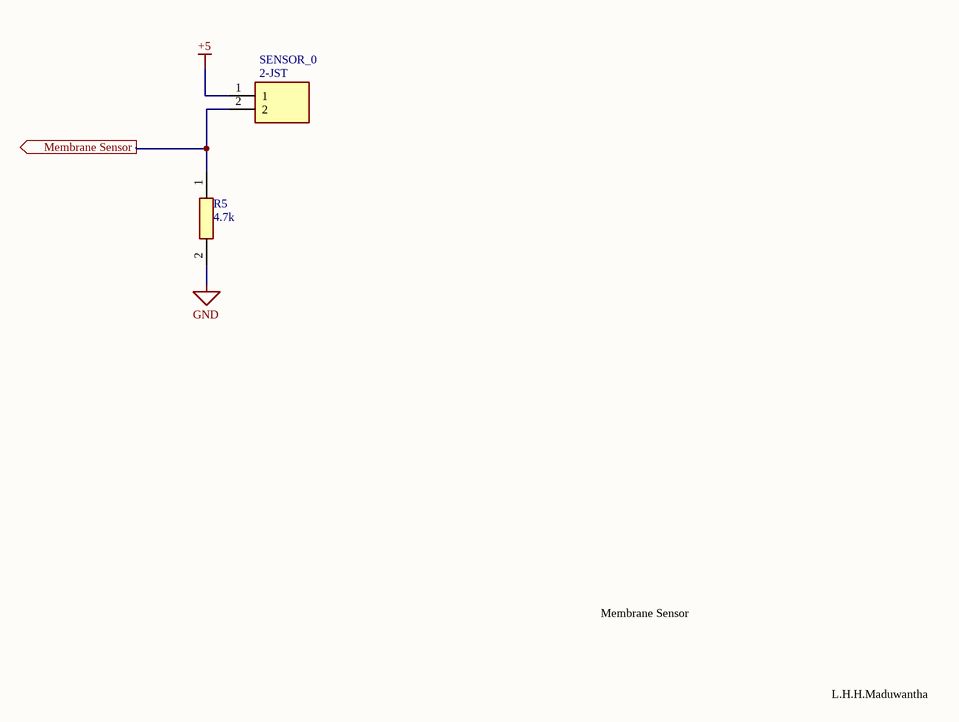
[diagram p5: MembraneSensor.SchDoc]

### Parts
R5  Resistance: 4.7k  [RESC1005X40N]  (hidden comment: RC0402FR-074K7L)
SENSOR_0  Name: 2-JST  [B2BXHAMLFSN]  (hidden comment: B2B-XH-AM_LF__SN_)

### Ports
Membrane Sensor (out, see Main[1B], MCU[1C])

### Nets
+5: SENSOR_0.1  [project net VCC]
GND: R5.2
NetIC1_97: R5.1 SENSOR_0.2 ; port Membrane Sensor

### Notes on the sheet
- Membrane Sensor
- L.H.H.Maduwantha

### Library data of the parts
R5 = RC0402FR-074K7L: Resistor; Manufacturer_Name: KEMET; Datasheet Link: http://www.yageo.com/documents/recent/PYu-RC0402_51_RoHS_L_6_r.pdf; Height: 0.4mm; Manufacturer_Part_Number: RC0402FR-074K7L; Mouser Part Number: 603-RC0402FR-074K7L; Mouser Price/Stock: https://www.mouser.co.uk/ProductDetail/YAGEO/RC0402FR-074K7L?qs=V1yeUXFNrkn%2FmCXC8N8TTA%3D%3D; Arrow Part Number: RC0402FR-074K7L; Arrow Price/Stock: https://www.arrow.com/en/products/rc0402fr-074k7l/yageo
SENSOR_0 = B2B-XH-AM_LF__SN_: as PWRIN_J on sheet Power; Datasheet Link: https://www.jst-mfg.com/product/pdf/eng/eXH.pdf; Height: 7mm; Arrow Part Number: B2B-XH-AM(LF)(SN); Arrow Price/Stock: https://www.arrow.com/en/products/b2b-xh-am-lf-sn/jst-manufacturing?region=europe

## Sheet PressureSensor.SchDoc
size A4; SheetNumber: 7; SheetTotal: 8
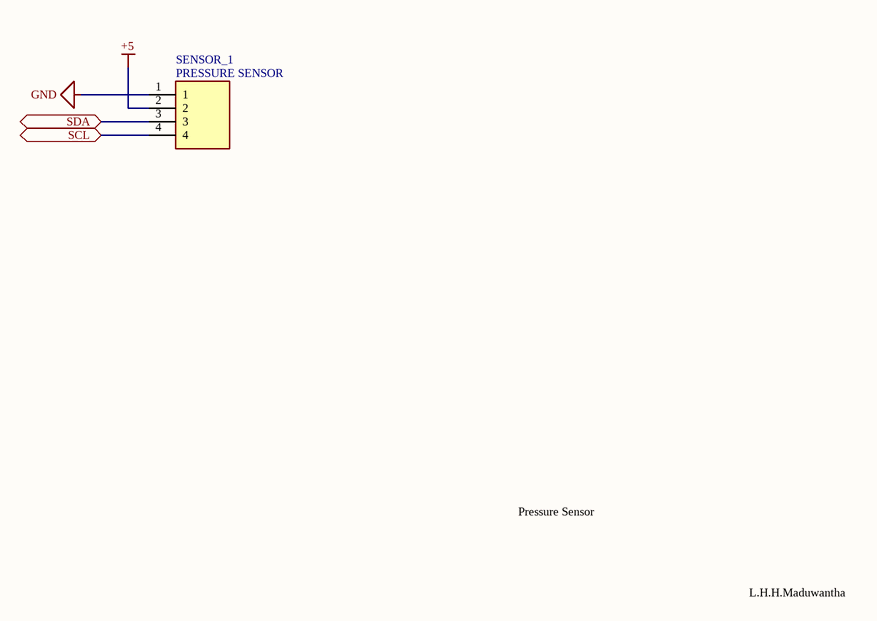
[diagram p6: PressureSensor.SchDoc]

### Parts
SENSOR_1  NAME: PRESSURE SENSOR  [B4BXHALFSN]  (hidden comment: B4B-XH-A_LF__SN_)

### Ports
SCL (bidir, see Main[3C], MCU[4B], UART_COM[2C]), SDA (bidir, see Main[3C], MCU[4B], UART_COM[2C])

### Nets
+5: SENSOR_1.2  [project net VCC]
GND: SENSOR_1.1
SCL: SENSOR_1.4 ; port SCL
SDA: SENSOR_1.3 ; port SDA

### Notes on the sheet
- Pressure Sensor
- L.H.H.Maduwantha

### Library data of the parts
SENSOR_1 = B4B-XH-A_LF__SN_: as J2 on sheet MotorDriver; Datasheet Link: https://datasheet.lcsc.com/szlcsc/JST-Sales-America-B4B-XH-A-LF-SN_C144395.pdf; Height: 7mm; Arrow Part Number: B4B-XH-A(LF)(SN); Arrow Price/Stock: https://www.arrow.com/en/products/b4b-xh-a-lf-sn/jst-manufacturing?region=europe

## Sheet UART_COM.SchDoc
size A4; SheetNumber: 8; SheetTotal: 8
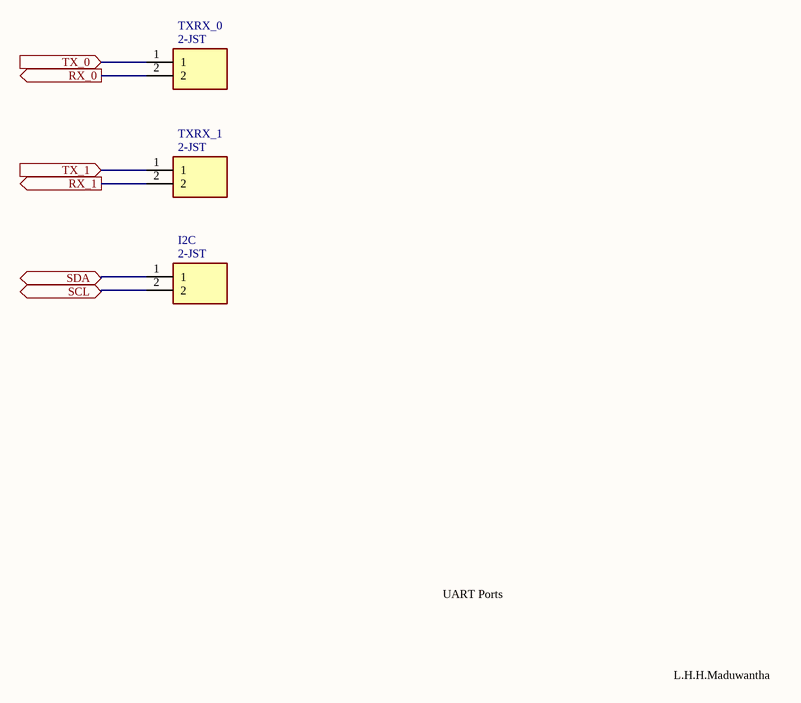
[diagram p7: UART_COM.SchDoc]

### Parts
I2C  Name: 2-JST  [B2BXHAMLFSN]  (hidden comment: B2B-XH-AM_LF__SN_)
TXRX_0  Name: 2-JST  [B2BXHAMLFSN]  (hidden comment: B2B-XH-AM_LF__SN_)
TXRX_1  Name: 2-JST  [B2BXHAMLFSN]  (hidden comment: B2B-XH-AM_LF__SN_)

### Ports
RX_0 (out, see Main[3B], MCU[2D]), RX_1 (out, see Main[3C], MCU[4B]), SCL (bidir, see Main[3C], MCU[4B], PressureSensor[2C]), SDA (bidir, see Main[3C], MCU[4B], PressureSensor[2C]), TX_0 (in, see Main[3B], MCU[2D]), TX_1 (in, see Main[3C], MCU[4B])

### Nets
SCL: I2C.2 ; port SCL
SDA: I2C.1 ; port SDA
NetIC1_2: TXRX_0.2 ; port RX_0
NetIC1_3: TXRX_0.1 ; port TX_0
NetIC1_45: TXRX_1.2 ; port RX_1
NetIC1_46: TXRX_1.1 ; port TX_1

### Notes on the sheet
- UART Ports
- L.H.H.Maduwantha

### Library data of the parts
I2C TXRX_0 TXRX_1 = B2B-XH-AM_LF__SN_: as PWRIN_J on sheet Power; Datasheet Link: https://www.jst-mfg.com/product/pdf/eng/eXH.pdf; Height: 7mm; Arrow Part Number: B2B-XH-AM(LF)(SN); Arrow Price/Stock: https://www.arrow.com/en/products/b2b-xh-am-lf-sn/jst-manufacturing?region=europe

## Nets that join several sheets
+12: Power (5 pins), MotorDriver (6 pins)
GND: MCU (16 pins), Power (14 pins), MotorDriver (13 pins), MembraneSensor (R5.2), PressureSensor (SENSOR_1.1)
VCC: MCU (16 pins), Power (C6.1 PS1.2 PS1.4), MotorDriver (6 pins), MembraneSensor (SENSOR_0.1), PressureSensor (SENSOR_1.2)
NetIC1_2: MCU (IC1.2), UART_COM (TXRX_0.2)
NetIC1_3: MCU (IC1.3), UART_COM (TXRX_0.1)
NetIC1_45: MCU (IC1.45), UART_COM (TXRX_1.2)
NetIC1_46: MCU (IC1.46), UART_COM (TXRX_1.1)
NetIC1_97: MCU (IC1.97), MembraneSensor (R5.1 SENSOR_0.2)
SCL: MCU (IC1.43 RN1.5), PressureSensor (SENSOR_1.4), UART_COM (I2C.2)
SDA: MCU (IC1.44 RN1.3), PressureSensor (SENSOR_1.3), UART_COM (I2C.1)